# EAGLE schematic Hauptplatine (EAGLE 7.7.0)

## Sheet 1 of 3
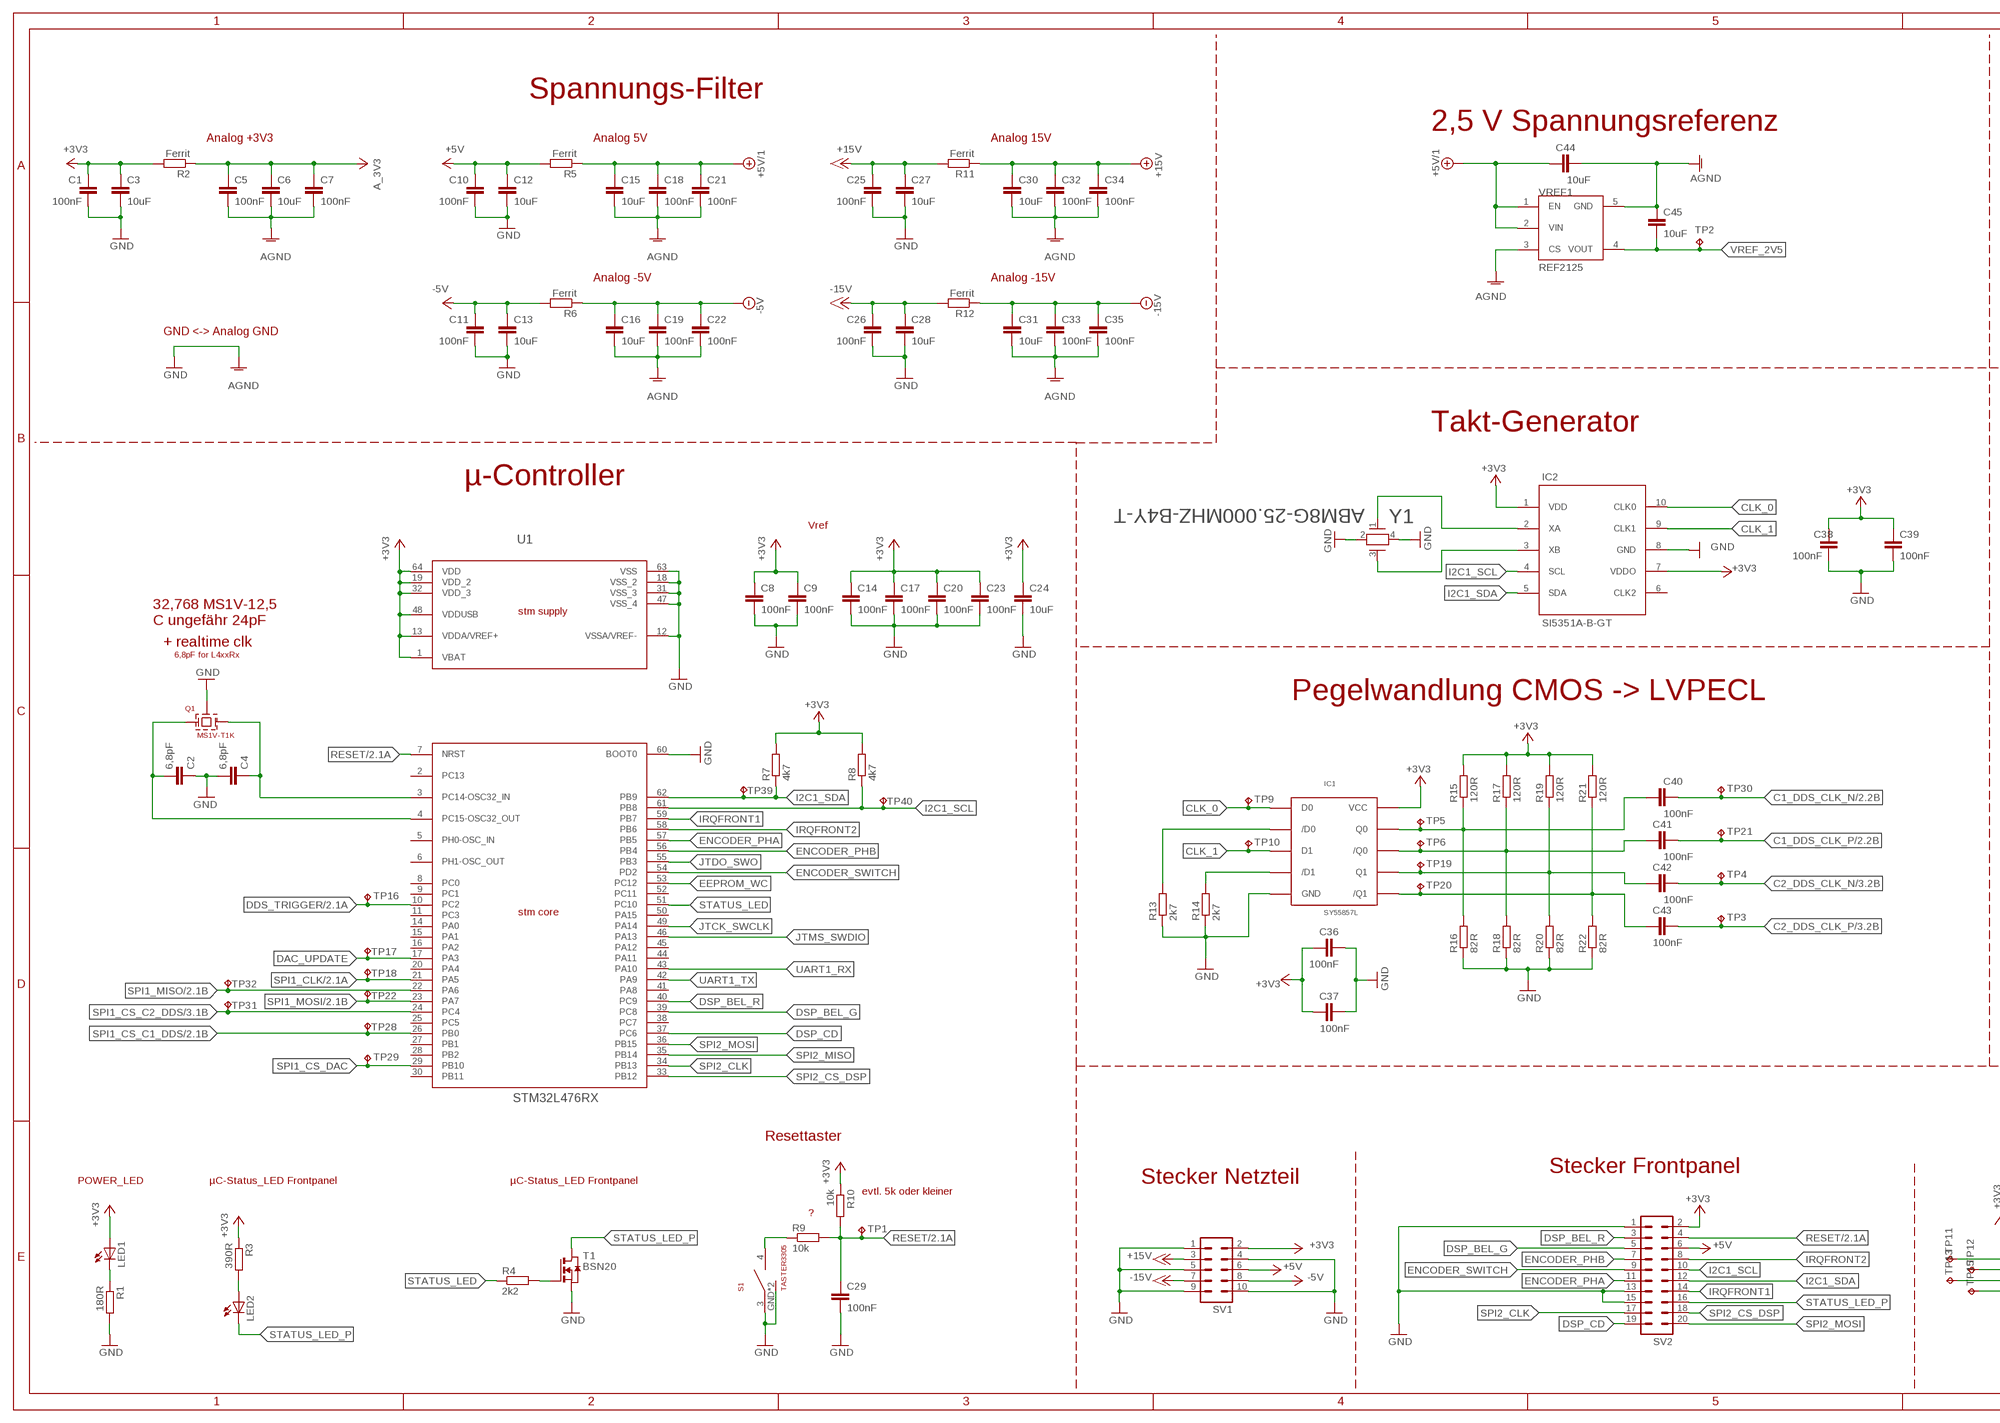
[diagram p0: schematic, sheet 1, part 1 of 2]
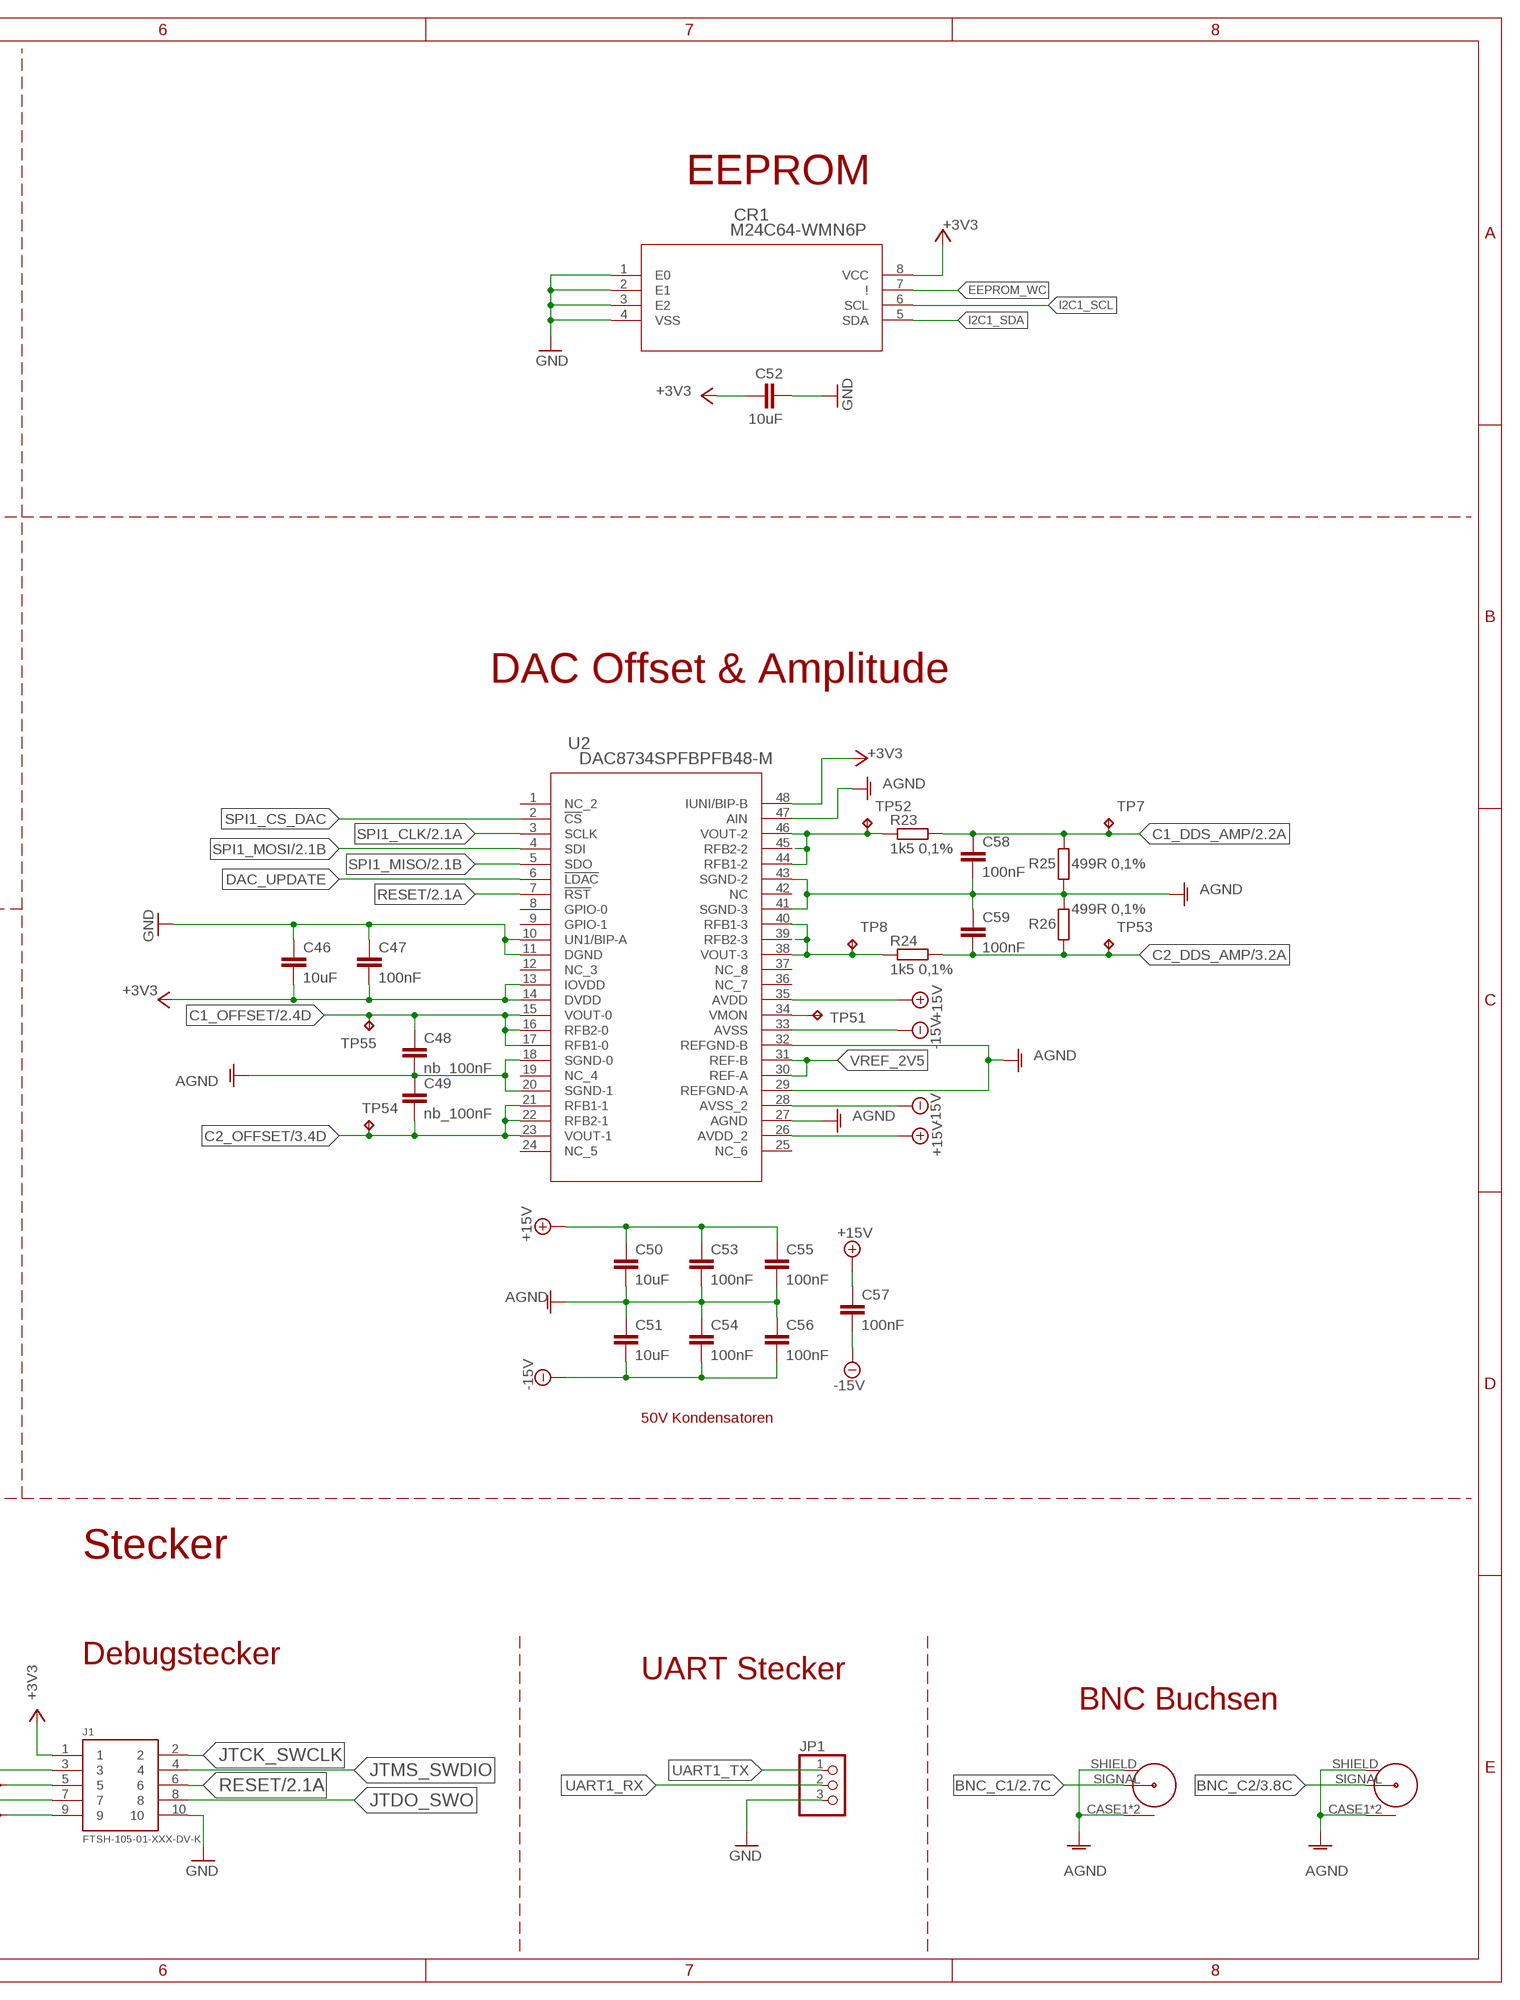
[diagram p1: schematic, sheet 1, part 2 of 2]

### Parts
C1  100nF  C-EUC0603  [C0603]
C2  6,8pF  C-EUC0603  [C0603]
C3  10uF  C-EUC0603  [C0603]
C4  6,8pF  C-EUC0603  [C0603]
C5  100nF  C-EUC0603  [C0603]
C6  10uF  C-EUC0603  [C0603]
C7  100nF  C-EUC0603  [C0603]
C8  100nF  C-EUC0603  [C0603]
C9  100nF  C-EUC0603  [C0603]
C10  100nF  C-EUC0603  [C0603]
C11  100nF  C-EUC0603  [C0603]
C12  10uF  C-EUC0603  [C0603]
C13  10uF  C-EUC0603  [C0603]
C14  100nF  C-EUC0603  [C0603]
C15  10uF  C-EUC0603  [C0603]
C16  10uF  C-EUC0603  [C0603]
C17  100nF  C-EUC0603  [C0603]
C18  100nF  C-EUC0603  [C0603]
C19  100nF  C-EUC0603  [C0603]
C20  100nF  C-EUC0603  [C0603]
C21  100nF  C-EUC0603  [C0603]
C22  100nF  C-EUC0603  [C0603]
C23  100nF  C-EUC0603  [C0603]
C24  10uF  C-EUC0603  [C0603]
C25  100nF  C-EUC0603  [C0603]
C26  100nF  C-EUC0603  [C0603]
C27  10uF  C-EUC0603  [C0603]
C28  10uF  C-EUC0603  [C0603]
C29  100nF  C-EUC0603  [C0603]
C30  10uF  C-EUC0603  [C0603]
C31  10uF  C-EUC0603  [C0603]
C32  100nF  C-EUC0603  [C0603]
C33  100nF  C-EUC0603  [C0603]
C34  100nF  C-EUC0603  [C0603]
C35  100nF  C-EUC0603  [C0603]
C36  100nF  C-EUC0603  [C0603]
C37  100nF  C-EUC0603  [C0603]
C38  100nF  C-EUC0603  [C0603]
C39  100nF  C-EUC0603  [C0603]
C40  100nF  C-EUC0603  [C0603]
C41  100nF  C-EUC0603  [C0603]
C42  100nF  C-EUC0603  [C0603]
C43  100nF  C-EUC0603  [C0603]
C44  10uF  C-EUC0603  [C0603]
C45  10uF  C-EUC0603  [C0603]
C46  10uF  C-EUC0603  [C0603]
C47  100nF  C-EUC0603  [C0603]
C48  nb_100nF  C-EUC0603  [C0603]
C49  nb_100nF  C-EUC0603  [C0603]
C50  10uF  C-EUC0603  [C0603]
C51  10uF  C-EUC0603  [C0603]
C52  10uF  C-EUC0603  [C0603]
C53  100nF  C-EUC0603  [C0603]
C54  100nF  C-EUC0603  [C0603]
C55  100nF  C-EUC0603  [C0603]
C56  100nF  C-EUC0603  [C0603]
C57  100nF  C-EUC0603  [C0603]
C58  100nF  C-EUC0603  [C0603]
C59  100nF  C-EUC0603  [C0603]
CR1  M24C64-WMN6P  [SO-8]
IC1  SY55857L  [MSOP(K10-1)]
IC2  SI5351A-B-GT  SI5351A  [MSOP10]
J1  FTSH-105-01-XXX-DV-K  [FTSH-105-01-XXX-DV-K]
JP1  PINHD-1X3  [1X03]
LED1  LEDCHIPLED_0603  [CHIPLED_0603]
LED2  LEDCHIPLED_0603  [CHIPLED_0603]
Q1  MS1V-T1K  [MS1V-T1K]
R1  180R  R-EU_R0603  [R0603]
R2  Ferrit  R-EU_R0603  [R0603]
R3  390R  R-EU_R0603  [R0603]
R4  2k2  R-EU_R0603  [R0603]
R5  Ferrit  R-EU_R0603  [R0603]
R6  Ferrit  R-EU_R0603  [R0603]
R7  4k7  R-EU_R0603  [R0603]
R8  4k7  R-EU_R0603  [R0603]
R9  10k  R-EU_R0603  [R0603]
R10  10k  R-EU_R0603  [R0603]
R11  Ferrit  R-EU_R0603  [R0603]
R12  Ferrit  R-EU_R0603  [R0603]
R13  2k7  R-EU_R0603  [R0603]
R14  2k7  R-EU_R0603  [R0603]
R15  120R  R-EU_R0603  [R0603]
R16  82R  R-EU_R0603  [R0603]
R17  120R  R-EU_R0603  [R0603]
R18  82R  R-EU_R0603  [R0603]
R19  120R  R-EU_R0603  [R0603]
R20  82R  R-EU_R0603  [R0603]
R21  120R  R-EU_R0603  [R0603]
R22  82R  R-EU_R0603  [R0603]
R23  1k5 0,1%  R-EU_R0603  [R0603]
R24  1k5 0,1%  R-EU_R0603  [R0603]
R25  499R 0,1%  R-EU_R0603  [R0603]
R26  499R 0,1%  R-EU_R0603  [R0603]
S1  TASTER3305  [TASTER3305]
SV1  ML10  [ML10]
SV2  ML20  [ML20]
T1  BSN20  NMOSSOT23  [SOT-23]
TP1  TPB1,27  [B1,27]
TP2  TPB1,27  [B1,27]
TP3  TPB1,27  [B1,27]
TP4  TPB1,27  [B1,27]
TP5  TPB1,27  [B1,27]
TP6  TPB1,27  [B1,27]
TP7  TPB1,27  [B1,27]
TP8  TPB1,27  [B1,27]
TP9  TPB1,27  [B1,27]
TP10  TPB1,27  [B1,27]
TP11  TPB1,27  [B1,27]
TP12  TPB1,27  [B1,27]
TP13  TPB1,27  [B1,27]
TP15  TPB1,27  [B1,27]
TP16  TPB1,27  [B1,27]
TP17  TPB1,27  [B1,27]
TP18  TPB1,27  [B1,27]
TP19  TPB1,27  [B1,27]
TP20  TPB1,27  [B1,27]
TP21  TPB1,27  [B1,27]
TP22  TPB1,27  [B1,27]
TP28  TPB1,27  [B1,27]
TP29  TPB1,27  [B1,27]
TP30  TPB1,27  [B1,27]
TP31  TPB1,27  [B1,27]
TP32  TPB1,27  [B1,27]
TP39  TPB1,27  [B1,27]
TP40  TPB1,27  [B1,27]
TP51  TPB1,27  [B1,27]
TP52  TPB1,27  [B1,27]
TP53  TPB1,27  [B1,27]
TP54  TPB1,27  [B1,27]
TP55  TPB1,27  [B1,27]
U1  STM32L476RX  [LQFP64-10X10MM]
U2  DAC8734SPFBPFB48-M  [PFB48-M]
VREF1  REF2125  REF2125SOT-23DBV  [SOT23-5L]
X1  740845_BNC  [740845_BNC]
X2  740845_BNC  [740845_BNC]
Y1  ABM8G-25.000MHZ-B4Y-T  ABM8G-12.000MHZ-B4Y-T  [CRYSTAL_ABM8G]

### Nets
+3V3: C1.1 C3.1 C8.1 C9.1 C14.1 C17.1 C20.1 C23.1 C24.1 C36.1 C37.1 C38.1 C39.1 C46.2 C47.2 C52.1 CR1.8(VCC) IC1.VCC IC2.1(VDD) IC2.7(VDDO) J1.1 LED1.A R2.2 R3.1 R7.2 R8.2 R10.1 R15.2 R17.2 R19.2 R21.2 SV1.2 SV2.2 U1.1(VBAT) U1.13(VDDA/VREF+) U1.19(VDD_2) U1.32(VDD_3) U1.48(VDDUSB) U1.64(VDD) U2.13(IOVDD) U2.14(DVDD) U2.48(IUNI/BIP-B) ; also sheet 2,3
+5V: C10.1 C12.1 R5.2 SV1.6 SV2.6
+5V/1: C15.1 C18.1 C21.1 C44.1 R5.1 VREF1.1(EN) VREF1.2(VIN) ; also sheet 2,3
+15V: C25.1 C27.1 R11.2 SV1.3
+18V: C30.1 C32.1 C34.1 C50.1 C53.1 C55.1 C57.1 R11.1 U2.26(AVDD_2) U2.35(AVDD) ; supply symbol labelled +15V ; also sheet 2,3
-5V: C16.1 C19.1 C22.1 R6.1 ; also sheet 2,3
-5V/D: C11.1 C13.1 R6.2 SV1.8 ; supply symbol labelled -5V
-15V: C26.1 C28.1 R12.2 SV1.7
-18V: C31.1 C33.1 C35.1 C51.2 C54.2 C56.2 C57.2 R12.1 U2.28(AVSS_2) U2.33(AVSS) ; supply symbol labelled -15V ; also sheet 2,3
ANALOG_3V3: C5.1 C6.1 C7.1 R2.1 ; supply symbol labelled A_3V3 ; also sheet 2,3
BNC_C1: X1.SIGNAL ; also sheet 2
BNC_C2: X2.SIGNAL ; also sheet 3
C1_DDS_AMP: C58.1 R23.2 R25.2 TP7.TP ; also sheet 2
C1_DDS_CLK_N: C40.1 TP30.TP ; also sheet 2
C1_DDS_CLK_P: C41.1 TP21.TP ; also sheet 2
C1_OFFSET: C48.1 TP55.TP U2.15(VOUT-0) U2.16(RFB2-0) U2.17(RFB1-0) ; also sheet 2
C2_DDS_AMP: C59.2 R24.2 R26.1 TP53.TP ; also sheet 3
C2_DDS_CLK_N: C42.1 TP4.TP ; also sheet 3
C2_DDS_CLK_P: C43.1 TP3.TP ; also sheet 3
C2_OFFSET: C49.2 TP54.TP U2.21(RFB1-1) U2.22(RFB2-1) U2.23(VOUT-1) ; also sheet 3
CLK_0: IC1.D0 IC2.10(CLK0) TP9.TP
CLK_1: IC1.D1 IC2.9(CLK1) TP10.TP
DAC_UPDATE: TP17.TP U1.17(PA3) U2.6(!LDAC)
DDS_TRIGGER: TP16.TP U1.10(PC2) ; also sheet 2,3
DSP_BEL_G: SV2.5 U1.39(PC8)
DSP_BEL_R: SV2.3 U1.40(PC9)
DSP_CD: SV2.19 U1.37(PC6)
EEPROM_WC: CR1.7(!) U1.53(PC12)
ENCODER_PHA: SV2.11 U1.57(PB5)
ENCODER_PHB: SV2.7 U1.56(PB4)
ENCODER_SWITCH: SV2.9 U1.54(PD2)
GND: C1.2 C2.1 C3.2 C4.2 C5.2 C6.2 C7.2 C8.2 C9.2 C10.2 C11.2 C12.2 C13.2 C14.2 C15.2 C16.2 C17.2 C18.2 C19.2 C20.2 C21.2 C22.2 C23.2 C24.2 C25.2 C26.2 C27.2 C28.2 C29.2 C30.2 C31.2 C32.2 C33.2 C34.2 C35.2 C36.2 C37.2 C38.2 C39.2 C44.2 C45.1 C46.1 C47.1 C48.2 C49.1 C50.2 C51.1 C52.2 C53.2 C54.1 C55.2 C56.1 C58.2 C59.1 CR1.1(E0) CR1.2(E1) CR1.3(E2) CR1.4(VSS) IC1.GND IC2.8(GND) J1.10 JP1.3 Q1.GND R1.2 R13.1 R14.1 R16.1 R18.1 R20.1 R22.1 R25.1 R26.2 S1.3 S1.GND S1.GND2(GND) SV1.1 SV1.4 SV1.5 SV1.9 SV1.10 SV2.1 SV2.13 SV2.15 T1.2(S) U1.12(VSSA/VREF-) U1.18(VSS_2) U1.31(VSS_3) U1.47(VSS_4) U1.60(BOOT0) U1.63(VSS) U2.10(UN1/BIP-A) U2.11(DGND) U2.18(SGND-0) U2.20(SGND-1) U2.27(AGND) U2.29(REFGND-A) U2.32(REFGND-B) U2.41(SGND-3) U2.43(SGND-2) U2.47(AIN) VREF1.3(CS) VREF1.5(GND) X1.CASE1(CASE) X1.CASE2(CASE) X1.SHIELD X2.CASE1(CASE) X2.CASE2(CASE) X2.SHIELD Y1.2 Y1.4 ; supply symbol labelled AGND ; also sheet 2,3
I2C1_SCL: CR1.6(SCL) IC2.4(SCL) R8.1 SV2.10 TP40.TP U1.61(PB8)
I2C1_SDA: CR1.5(SDA) IC2.5(SDA) R7.1 SV2.12 TP39.TP U1.62(PB9)
IRQFRONT1: SV2.14 U1.59(PB7)
IRQFRONT2: SV2.8 U1.58(PB6)
JTCK_SWCLK: J1.2 U1.49(PA14)
JTDO_SWO: J1.8 U1.55(PB3)
JTMS_SWDIO: J1.4 U1.46(PA13)
N$1: R9.1 S1.4
N$2: LED1.C R1.1
N$4: R23.1 TP52.TP U2.44(RFB1-2) U2.45(RFB2-2) U2.46(VOUT-2)
N$13: IC2.2(XA) Y1.1
N$15: IC2.3(XB) Y1.3
N$17: J1.3 TP11.TP
N$21: R24.1 TP8.TP U2.38(VOUT-3) U2.39(RFB2-3) U2.40(RFB1-3)
N$23: C2.2 Q1.1 U1.4(PC15-OSC32_OUT)
N$27: R4.2 T1.3(G)
N$30: LED2.A R3.2
N$31: J1.5 TP12.TP
N$34: J1.7 TP13.TP
N$35: IC1./D1 R14.2
N$36: IC1./D0 R13.2
N$37: C40.2 IC1.Q0 R15.1 R16.2 TP5.TP
N$38: C41.2 IC1./Q0 R17.1 R18.2 TP6.TP
N$39: C42.2 IC1.Q1 R19.1 R20.2 TP19.TP
N$40: J1.9 TP15.TP
N$41: C43.2 IC1./Q1 R21.1 R22.2 TP20.TP
N$46: TP51.TP U2.34(VMON)
N$47: C4.1 Q1.2 U1.3(PC14-OSC32_IN)
RESET: C29.1 J1.6 R9.2 R10.2 SV2.4 TP1.TP U1.7(NRST) U2.7(!RST) ; also sheet 2,3
SPI1_CLK: TP18.TP U1.21(PA5) U2.3(SCLK) ; also sheet 2,3
SPI1_CS_C1_DDS: TP28.TP U1.26(PB0) ; also sheet 2
SPI1_CS_C2_DDS: TP31.TP U1.24(PC4) ; also sheet 3
SPI1_CS_DAC: TP29.TP U1.29(PB10) U2.2(!CS)
SPI1_MISO: TP32.TP U1.22(PA6) U2.5(SDO) ; also sheet 2,3
SPI1_MOSI: TP22.TP U1.23(PA7) U2.4(SDI) ; also sheet 2,3
SPI2_CLK: SV2.17 U1.34(PB13)
SPI2_CS_DSP: SV2.18 U1.33(PB12)
SPI2_MISO: U1.35(PB14)
SPI2_MOSI: SV2.20 U1.36(PB15)
STATUS_LED: R4.1 U1.51(PC10)
STATUS_LED_P: LED2.C SV2.16 T1.1(D)
UART1_RX: JP1.2 U1.43(PA10)
UART1_TX: JP1.1 U1.42(PA9)
VREF_2V5: C45.2 TP2.TP U2.30(REF-A) U2.31(REF-B) VREF1.4(VOUT)
Unconnected: IC2.6(CLK2) U1.2(PC13) U1.5(PH0-OSC_IN) U1.6(PH1-OSC_OUT) U1.8(PC0) U1.9(PC1) U1.11(PC3) U1.14(PA0) U1.15(PA1) U1.16(PA2) U1.20(PA4) U1.25(PC5) U1.27(PB1) U1.28(PB2) U1.30(PB11) U1.38(PC7) U1.41(PA8) U1.44(PA11) U1.45(PA12) U1.50(PA15) U1.52(PC11) U2.1(NC_2) U2.8(GPIO-0) U2.9(GPIO-1) U2.12(NC_3) U2.19(NC_4) U2.24(NC_5) U2.25(NC_6) U2.36(NC_7) U2.37(NC_8) U2.42(NC)

### Notes on the sheet
- Logicboard Waveformgenerator V2
- Spannungs-Filter
- 2,5 V Spannungsreferenz | EEPROM
- Analog +3V3 | Analog 5V | Analog 15V
- Analog -5V | Analog -15V
- GND <-> Analog GND
- Takt-Generator
- µ-Controller | DAC Offset & Amplitude
- Vref
- 32,768 MS1V-12,5
  C ungefähr 24pF
- + realtime clk
- 6,8pF for L4xxRx
- Pegelwandlung CMOS -> LVPECL
- 50V Kondensatoren
- Stecker
- Resettaster
- Stecker Frontpanel
- POWER_LED | µC-Status_LED Frontpanel | µC-Status_LED Frontpanel | Stecker Netzteil | Debugstecker
- evtl. 5k oder kleiner | UART Stecker
- ? | BNC Buchsen

## Sheet 2 of 3: Channel 1
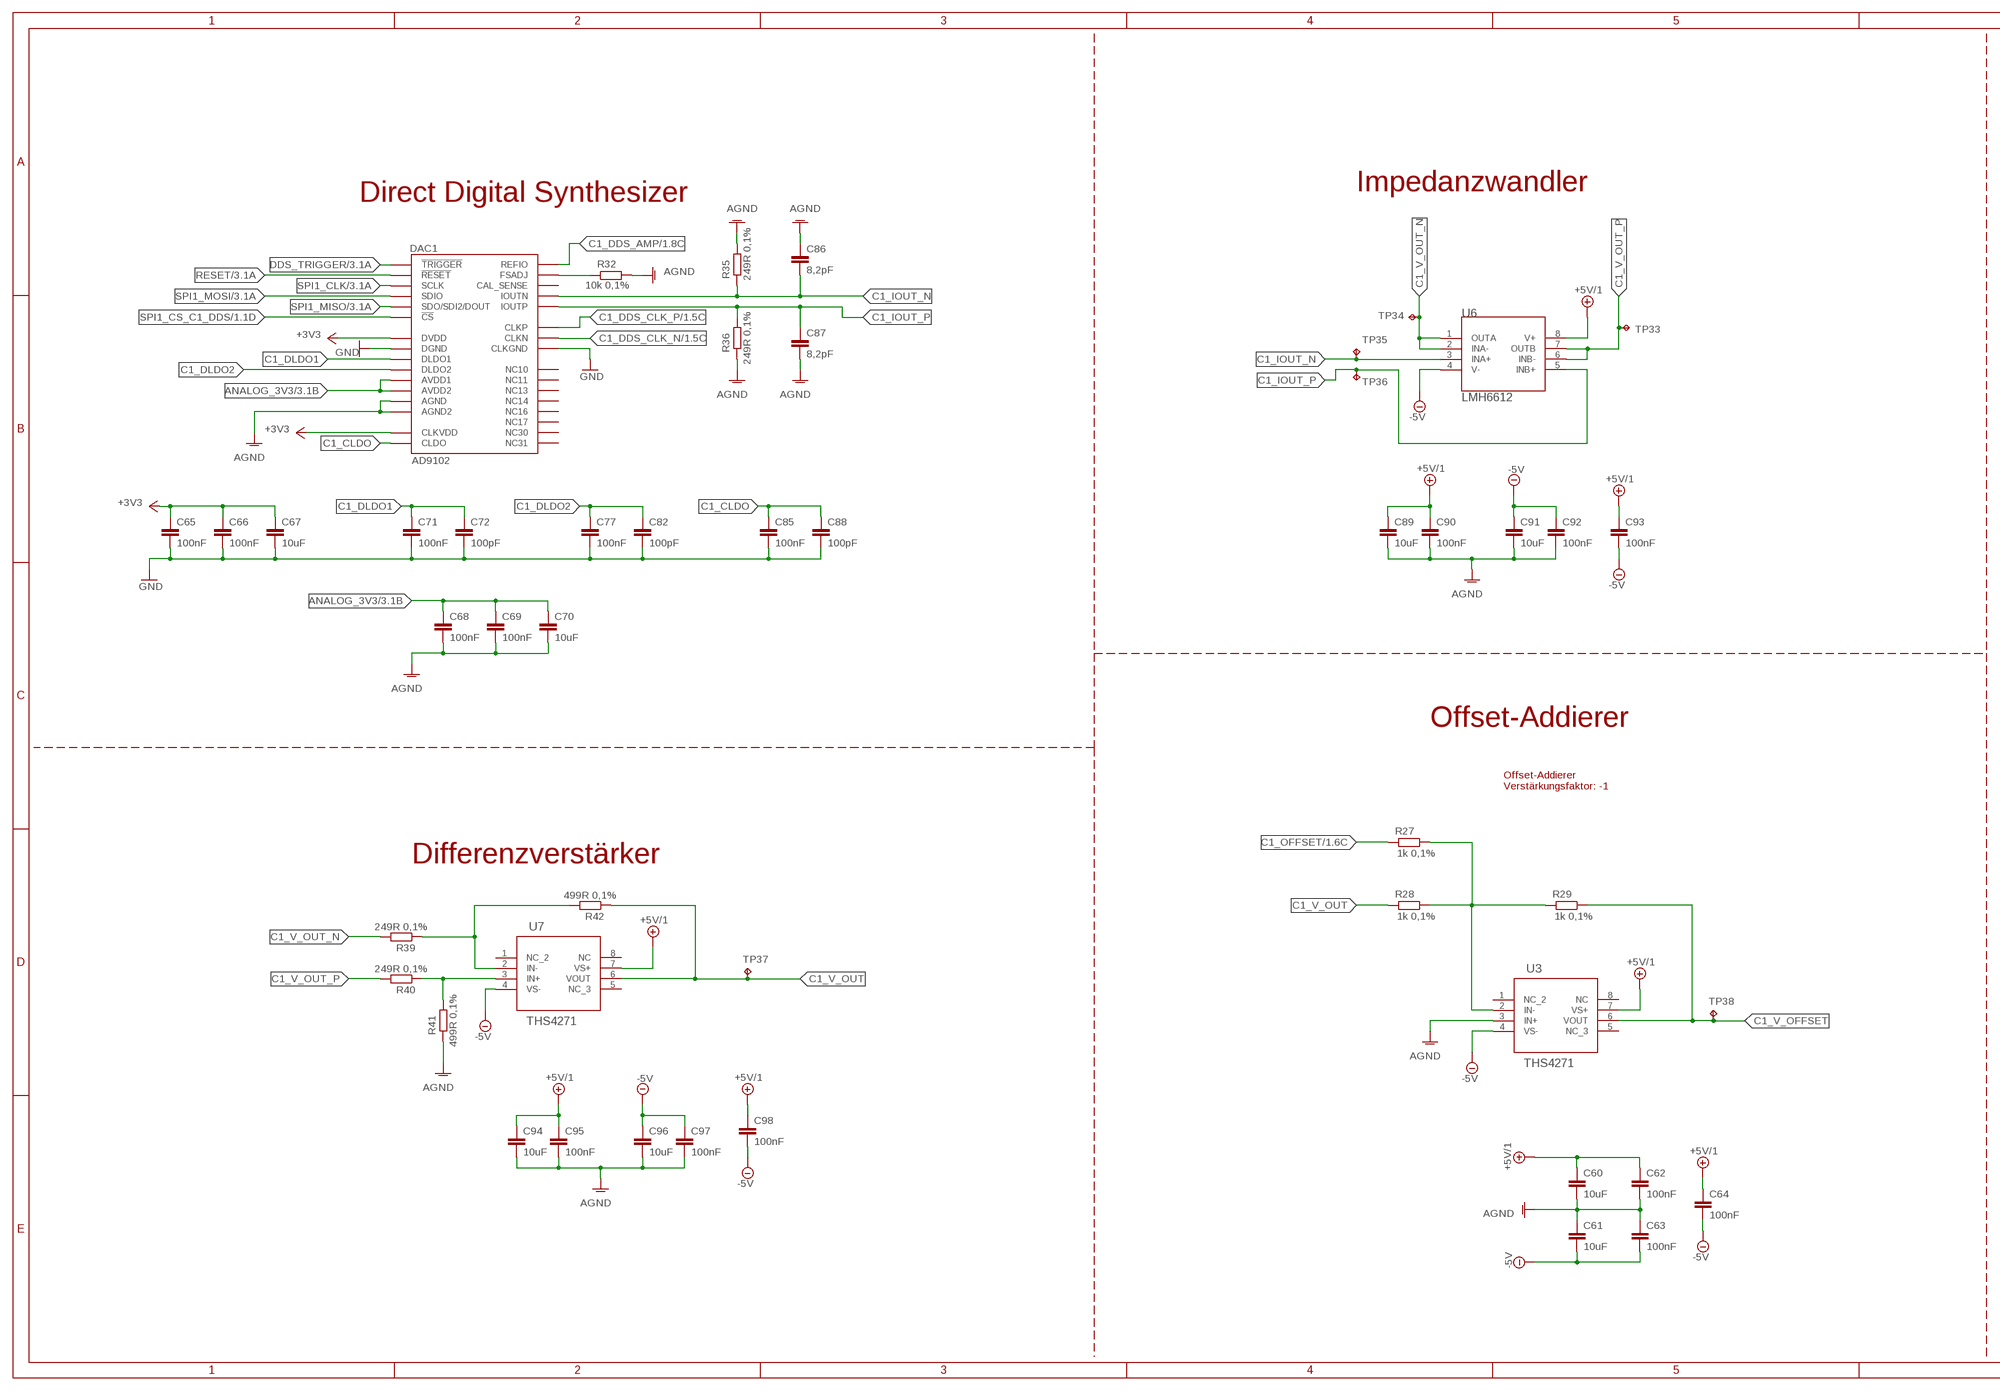
[diagram p2: schematic, sheet 2, part 1 of 2]
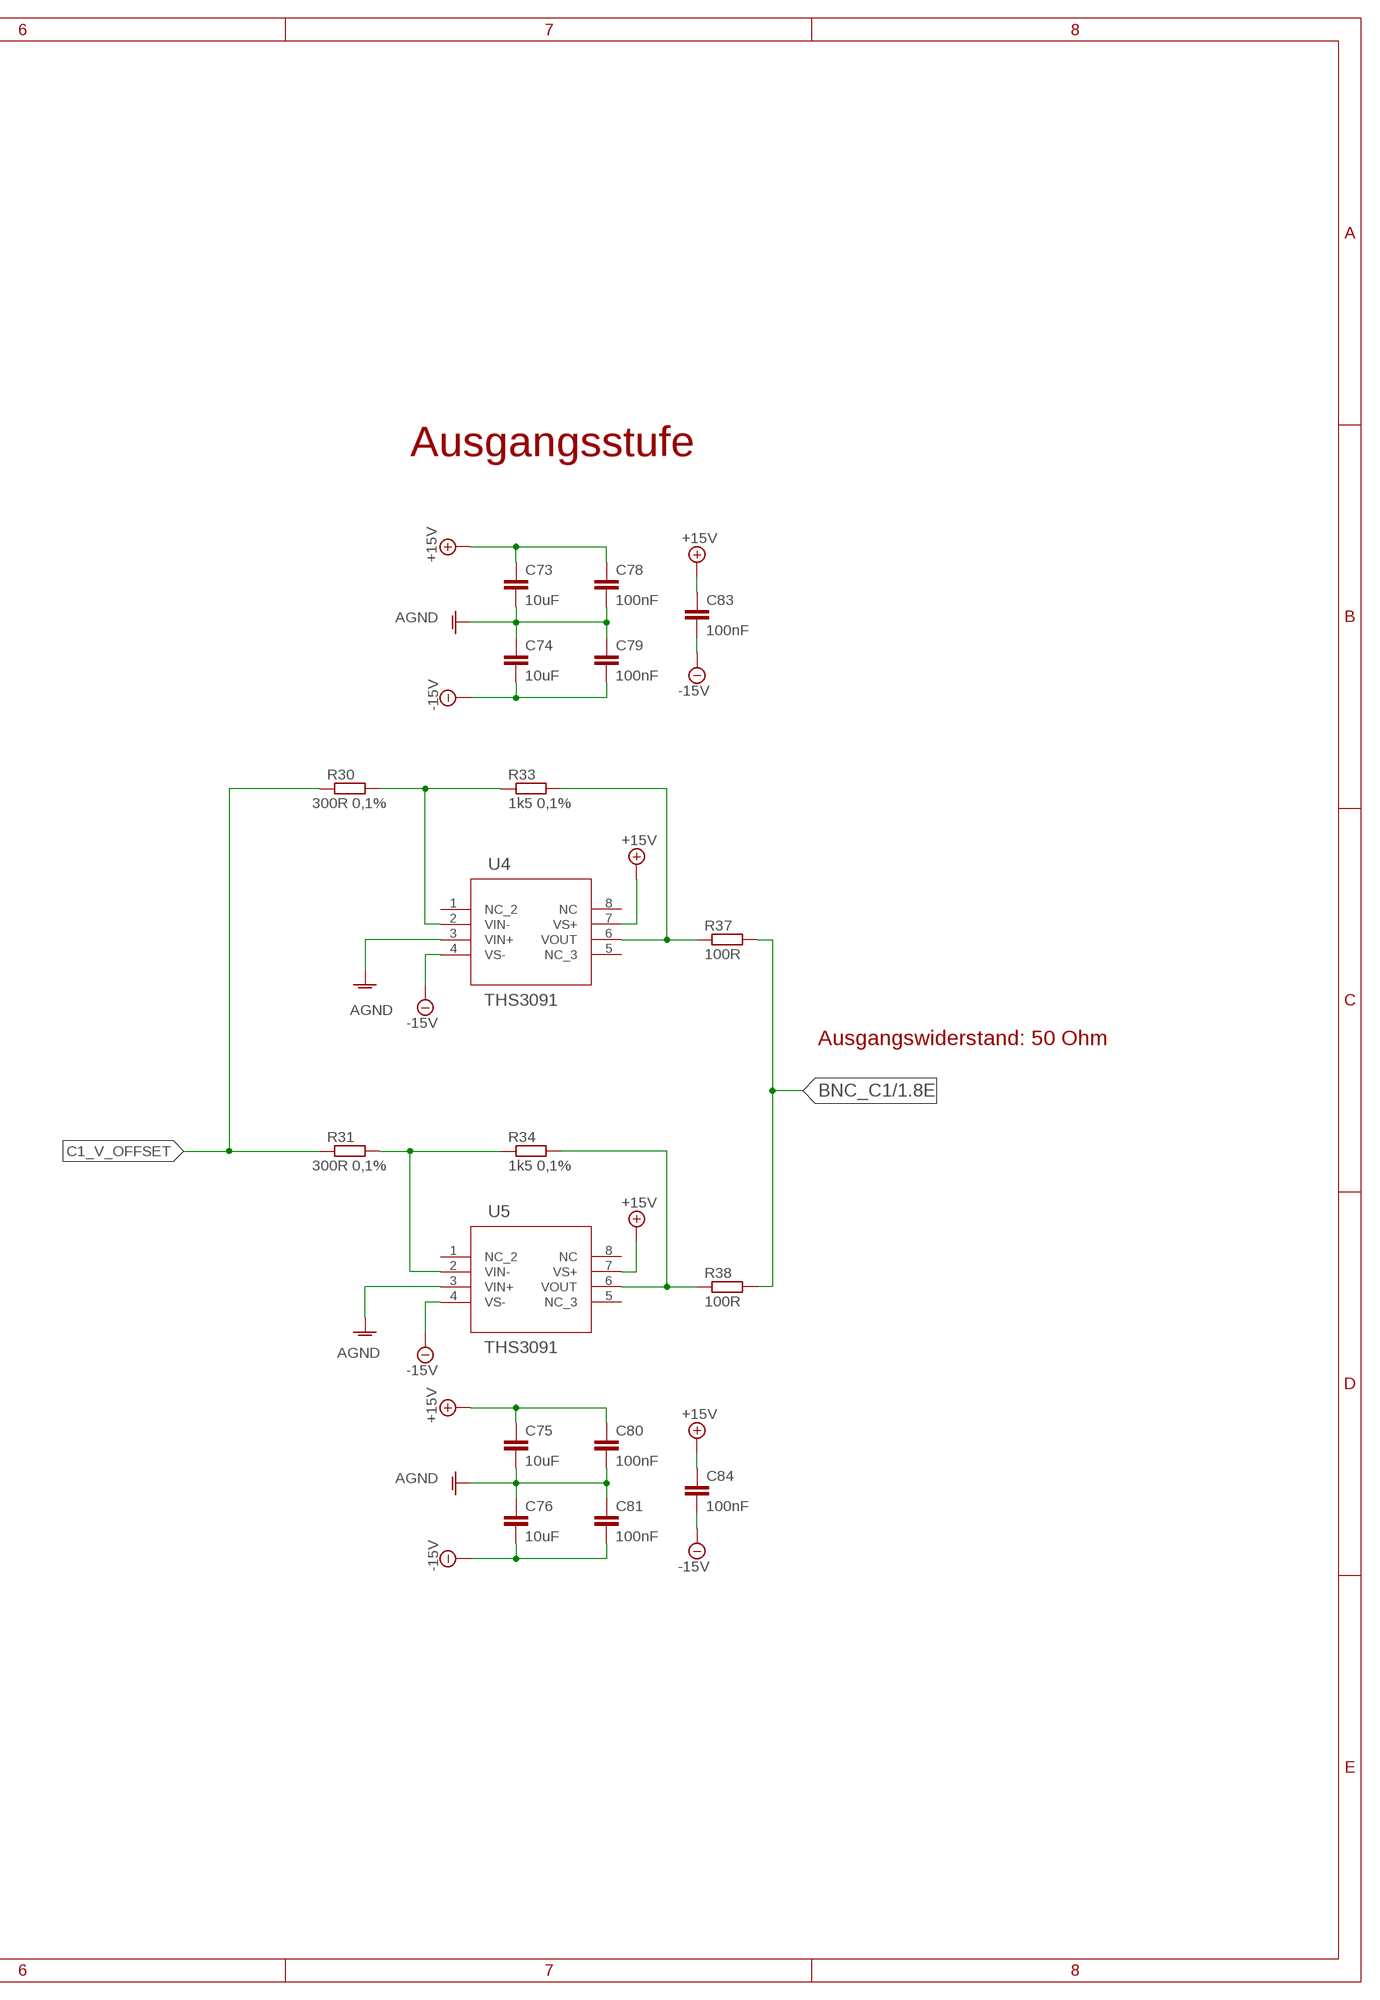
[diagram p3: schematic, sheet 2, part 2 of 2]

### Parts
C60  10uF  C-EUC0603  [C0603]
C61  10uF  C-EUC0603  [C0603]
C62  100nF  C-EUC0603  [C0603]
C63  100nF  C-EUC0603  [C0603]
C64  100nF  C-EUC0603  [C0603]
C65  100nF  C-EUC0603  [C0603]
C66  100nF  C-EUC0603  [C0603]
C67  10uF  C-EUC0603  [C0603]
C68  100nF  C-EUC0603  [C0603]
C69  100nF  C-EUC0603  [C0603]
C70  10uF  C-EUC0603  [C0603]
C71  100nF  C-EUC0603  [C0603]
C72  100pF  C-EUC0603  [C0603]
C73  10uF  C-EUC0603  [C0603]
C74  10uF  C-EUC0603  [C0603]
C75  10uF  C-EUC0603  [C0603]
C76  10uF  C-EUC0603  [C0603]
C77  100nF  C-EUC0603  [C0603]
C78  100nF  C-EUC0603  [C0603]
C79  100nF  C-EUC0603  [C0603]
C80  100nF  C-EUC0603  [C0603]
C81  100nF  C-EUC0603  [C0603]
C82  100pF  C-EUC0603  [C0603]
C83  100nF  C-EUC0603  [C0603]
C84  100nF  C-EUC0603  [C0603]
C85  100nF  C-EUC0603  [C0603]
C86  8,2pF  C-EUC0603  [C0603]
C87  8,2pF  C-EUC0603  [C0603]
C88  100pF  C-EUC0603  [C0603]
C89  10uF  C-EUC0603  [C0603]
C90  100nF  C-EUC0603  [C0603]
C91  10uF  C-EUC0603  [C0603]
C92  100nF  C-EUC0603  [C0603]
C93  100nF  C-EUC0603  [C0603]
C94  10uF  C-EUC0603  [C0603]
C95  100nF  C-EUC0603  [C0603]
C96  10uF  C-EUC0603  [C0603]
C97  100nF  C-EUC0603  [C0603]
C98  100nF  C-EUC0603  [C0603]
DAC1  AD9102  [CP_32_12]
R27  1k 0,1%  R-EU_R0603  [R0603]
R28  1k 0,1%  R-EU_R0603  [R0603]
R29  1k 0,1%  R-EU_R0603  [R0603]
R30  300R 0,1%  R-EU_R0603  [R0603]
R31  300R 0,1%  R-EU_R0603  [R0603]
R32  10k 0,1%  R-EU_R0603  [R0603]
R33  1k5 0,1%  R-EU_R0603  [R0603]
R34  1k5 0,1%  R-EU_R0603  [R0603]
R35  249R 0,1%  R-EU_R0603  [R0603]
R36  249R 0,1%  R-EU_R0603  [R0603]
R37  100R  R-EU_R0603  [R0603]
R38  100R  R-EU_R0603  [R0603]
R39  249R 0,1%  R-EU_R0603  [R0603]
R40  249R 0,1%  R-EU_R0603  [R0603]
R41  499R 0,1%  R-EU_R0603  [R0603]
R42  499R 0,1%  R-EU_R0603  [R0603]
TP33  TPB1,27  [B1,27]
TP34  TPB1,27  [B1,27]
TP35  TPB1,27  [B1,27]
TP36  TPB1,27  [B1,27]
TP37  TPB1,27  [B1,27]
TP38  TPB1,27  [B1,27]
U3  THS4271  THS4271_D_8D8-M  [D8-M]
U4  THS3091  THS3091_D_8D8-M  [D8-M]
U5  THS3091  THS3091_D_8D8-M  [D8-M]
U6  LMH6612  LMH6612MAX/NOPBM08A-M  [M08A-M]
U7  THS4271  THS4271_D_8D8-M  [D8-M]

### Nets
+3V3: C65.1 C66.1 C67.1 DAC1.5(DVDD) DAC1.23(CLKVDD) ; also sheet 1,3
+5V/1: C60.1 C62.1 C64.1 C89.1 C90.1 C93.1 C94.1 C95.1 C98.1 U3.7(VS+) U6.8(V+) U7.7(VS+) ; also sheet 1,3
+18V: C73.1 C75.1 C78.1 C80.1 C83.1 C84.1 U4.7(VS+) U5.7(VS+) ; supply symbol labelled +15V ; also sheet 1,3
-5V: C61.2 C63.2 C64.2 C91.1 C92.1 C93.2 C96.1 C97.1 C98.2 U3.4(VS-) U6.4(V-) U7.4(VS-) ; also sheet 1,3
-18V: C74.2 C76.2 C79.2 C81.2 C83.2 C84.2 U4.4(VS-) U5.4(VS-) ; supply symbol labelled -15V ; also sheet 1,3
ANALOG_3V3: C68.1 C69.1 C70.1 DAC1.12(AVDD2) DAC1.29(AVDD1) ; also sheet 1,3
BNC_C1: R37.2 R38.2 ; also sheet 1
C1_CLDO: C85.1 C88.1 DAC1.22(CLDO)
C1_DDS_AMP: DAC1.18(REFIO) ; also sheet 1
C1_DDS_CLK_N: DAC1.20(CLKN) ; also sheet 1
C1_DDS_CLK_P: DAC1.21(CLKP) ; also sheet 1
C1_DLDO1: C71.1 C72.1 DAC1.6(DLDO1)
C1_DLDO2: C77.1 C82.1 DAC1.4(DLDO2)
C1_IOUT_N: C86.2 DAC1.28(IOUTN) R35.1 TP35.TP U6.3(INA+)
C1_IOUT_P: C87.1 DAC1.27(IOUTP) R36.2 TP36.TP U6.5(INB+)
C1_OFFSET: R27.2 ; also sheet 1
C1_V_OFFSET: R29.1 R30.1 R31.1 TP38.TP U3.6(VOUT)
C1_V_OUT: R28.2 R42.1 TP37.TP U7.6(VOUT)
C1_V_OUT_N: R39.2 TP34.TP U6.1(OUTA) U6.2(INA-)
C1_V_OUT_P: R40.2 TP33.TP U6.6(INB-) U6.7(OUTB)
DDS_TRIGGER: DAC1.32(!TRIGGER) ; also sheet 1,3
GND: C60.2 C61.1 C62.2 C63.1 C65.2 C66.2 C67.2 C68.2 C69.2 C70.2 C71.2 C72.2 C73.2 C74.1 C75.2 C76.1 C77.2 C78.2 C79.1 C80.2 C81.1 C82.2 C85.2 C86.1 C87.2 C88.2 C89.2 C90.2 C91.2 C92.2 C94.2 C95.2 C96.2 C97.2 DAC1.3(DGND) DAC1.15(AGND) DAC1.19(CLKGND) DAC1.26(AGND2) DAC1.33(DGND) R32.2 R35.2 R36.1 R41.1 U3.3(IN+) U4.3(VIN+) U5.3(VIN+) ; supply symbol labelled AGND ; also sheet 1,3
N$3: DAC1.25(FSADJ) R32.1
N$14: R40.1 R41.2 U7.3(IN+)
N$16: R39.1 R42.2 U7.2(IN-)
N$25: R33.2 R37.1 U4.6(VOUT)
N$26: R31.2 R34.1 U5.2(VIN-)
N$28: R34.2 R38.1 U5.6(VOUT)
N$33: R30.2 R33.1 U4.2(VIN-)
N$42: R27.1 R28.1 R29.2 U3.2(IN-)
RESET: DAC1.9(!RESET) ; also sheet 1,3
SPI1_CLK: DAC1.1(SCLK) ; also sheet 1,3
SPI1_CS_C1_DDS: DAC1.8(!CS) ; also sheet 1
SPI1_MISO: DAC1.7(SDO/SDI2/DOUT) ; also sheet 1,3
SPI1_MOSI: DAC1.2(SDIO) ; also sheet 1,3
Unconnected: DAC1.10(NC10) DAC1.11(NC11) DAC1.13(NC13) DAC1.14(NC14) DAC1.16(NC16) DAC1.17(NC17) DAC1.24(CAL_SENSE) DAC1.30(NC30) DAC1.31(NC31) U3.1(NC_2) U3.5(NC_3) U3.8(NC) U4.1(NC_2) U4.5(NC_3) U4.8(NC) U5.1(NC_2) U5.5(NC_3) U5.8(NC) U7.1(NC_2) U7.5(NC_3) U7.8(NC)

### Notes on the sheet
- Signalerzeugung Kanal 1
- Impedanzwandler
- Direct Digital Synthesizer
- Ausgangsstufe
- Offset-Addierer | Ausgangswiderstand: 50 Ohm
- Offset-Addierer
  Verstärkungsfaktor: -1
- Differenzverstärker

## Sheet 3 of 3: Channel 2
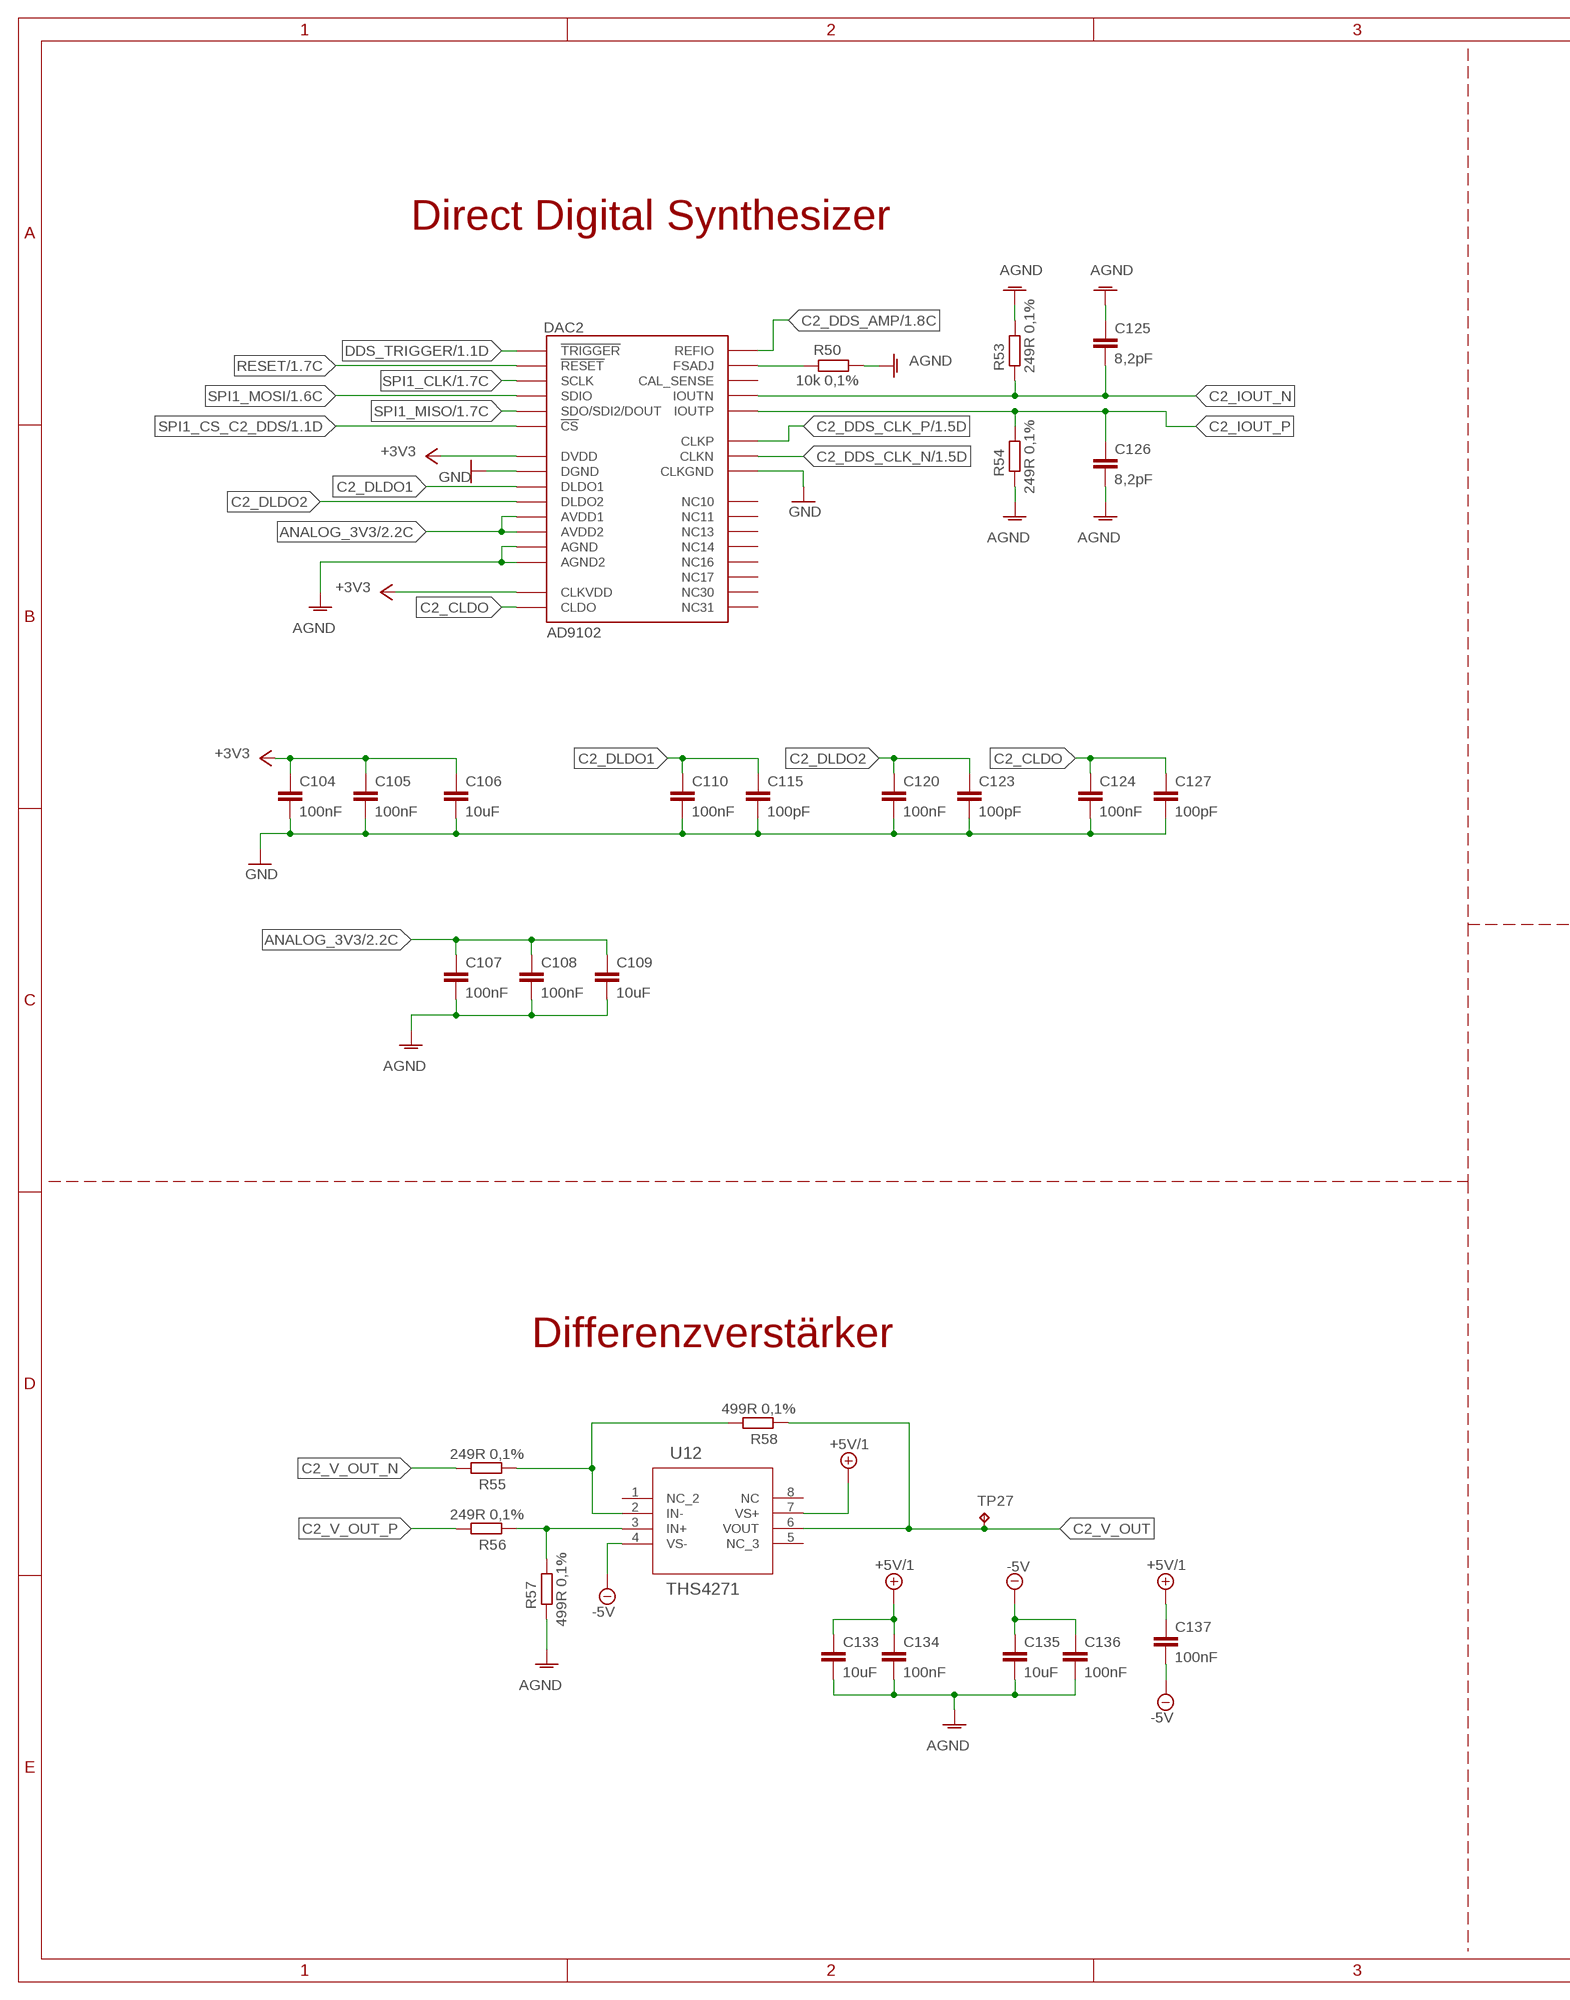
[diagram p4: schematic, sheet 3, part 1 of 2]
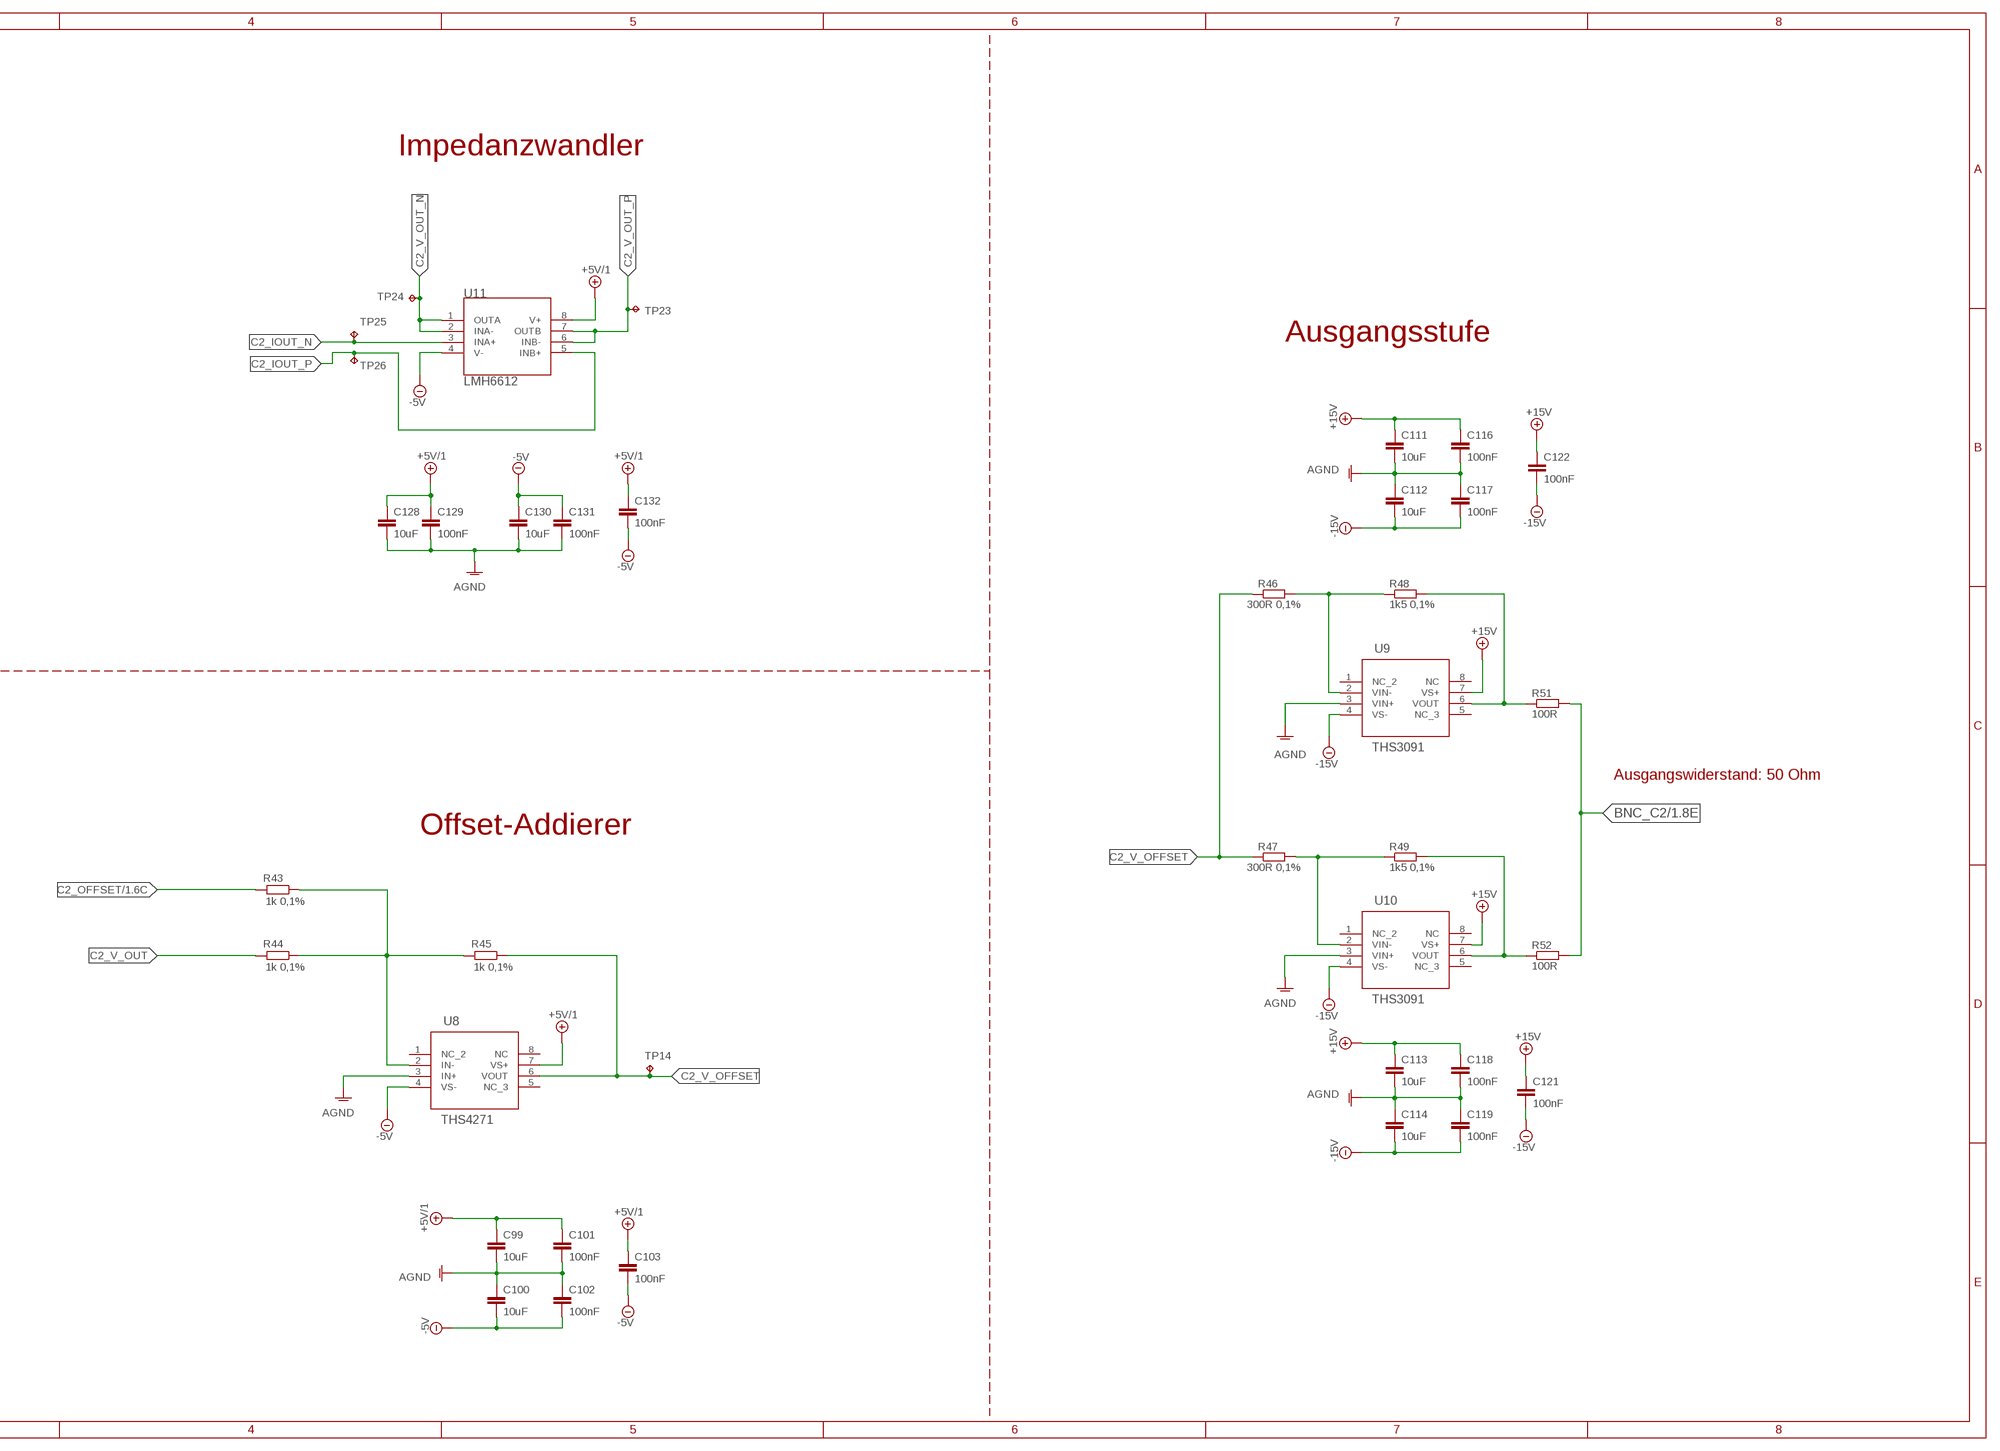
[diagram p5: schematic, sheet 3, part 2 of 2]

### Parts
C99  10uF  C-EUC0603  [C0603]
C100  10uF  C-EUC0603  [C0603]
C101  100nF  C-EUC0603  [C0603]
C102  100nF  C-EUC0603  [C0603]
C103  100nF  C-EUC0603  [C0603]
C104  100nF  C-EUC0603  [C0603]
C105  100nF  C-EUC0603  [C0603]
C106  10uF  C-EUC0603  [C0603]
C107  100nF  C-EUC0603  [C0603]
C108  100nF  C-EUC0603  [C0603]
C109  10uF  C-EUC0603  [C0603]
C110  100nF  C-EUC0603  [C0603]
C111  10uF  C-EUC0603  [C0603]
C112  10uF  C-EUC0603  [C0603]
C113  10uF  C-EUC0603  [C0603]
C114  10uF  C-EUC0603  [C0603]
C115  100pF  C-EUC0603  [C0603]
C116  100nF  C-EUC0603  [C0603]
C117  100nF  C-EUC0603  [C0603]
C118  100nF  C-EUC0603  [C0603]
C119  100nF  C-EUC0603  [C0603]
C120  100nF  C-EUC0603  [C0603]
C121  100nF  C-EUC0603  [C0603]
C122  100nF  C-EUC0603  [C0603]
C123  100pF  C-EUC0603  [C0603]
C124  100nF  C-EUC0603  [C0603]
C125  8,2pF  C-EUC0603  [C0603]
C126  8,2pF  C-EUC0603  [C0603]
C127  100pF  C-EUC0603  [C0603]
C128  10uF  C-EUC0603  [C0603]
C129  100nF  C-EUC0603  [C0603]
C130  10uF  C-EUC0603  [C0603]
C131  100nF  C-EUC0603  [C0603]
C132  100nF  C-EUC0603  [C0603]
C133  10uF  C-EUC0603  [C0603]
C134  100nF  C-EUC0603  [C0603]
C135  10uF  C-EUC0603  [C0603]
C136  100nF  C-EUC0603  [C0603]
C137  100nF  C-EUC0603  [C0603]
DAC2  AD9102  [CP_32_12]
R43  1k 0,1%  R-EU_R0603  [R0603]
R44  1k 0,1%  R-EU_R0603  [R0603]
R45  1k 0,1%  R-EU_R0603  [R0603]
R46  300R 0,1%  R-EU_R0603  [R0603]
R47  300R 0,1%  R-EU_R0603  [R0603]
R48  1k5 0,1%  R-EU_R0603  [R0603]
R49  1k5 0,1%  R-EU_R0603  [R0603]
R50  10k 0,1%  R-EU_R0603  [R0603]
R51  100R  R-EU_R0603  [R0603]
R52  100R  R-EU_R0603  [R0603]
R53  249R 0,1%  R-EU_R0603  [R0603]
R54  249R 0,1%  R-EU_R0603  [R0603]
R55  249R 0,1%  R-EU_R0603  [R0603]
R56  249R 0,1%  R-EU_R0603  [R0603]
R57  499R 0,1%  R-EU_R0603  [R0603]
R58  499R 0,1%  R-EU_R0603  [R0603]
TP14  TPB1,27  [B1,27]
TP23  TPB1,27  [B1,27]
TP24  TPB1,27  [B1,27]
TP25  TPB1,27  [B1,27]
TP26  TPB1,27  [B1,27]
TP27  TPB1,27  [B1,27]
U8  THS4271  THS4271_D_8D8-M  [D8-M]
U9  THS3091  THS3091_D_8D8-M  [D8-M]
U10  THS3091  THS3091_D_8D8-M  [D8-M]
U11  LMH6612  LMH6612MAX/NOPBM08A-M  [M08A-M]
U12  THS4271  THS4271_D_8D8-M  [D8-M]

### Nets
+3V3: C104.1 C105.1 C106.1 DAC2.5(DVDD) DAC2.23(CLKVDD) ; also sheet 1,2
+5V/1: C99.1 C101.1 C103.1 C128.1 C129.1 C132.1 C133.1 C134.1 C137.1 U8.7(VS+) U11.8(V+) U12.7(VS+) ; also sheet 1,2
+18V: C111.1 C113.1 C116.1 C118.1 C121.1 C122.1 U9.7(VS+) U10.7(VS+) ; supply symbol labelled +15V ; also sheet 1,2
-5V: C100.2 C102.2 C103.2 C130.1 C131.1 C132.2 C135.1 C136.1 C137.2 U8.4(VS-) U11.4(V-) U12.4(VS-) ; also sheet 1,2
-18V: C112.2 C114.2 C117.2 C119.2 C121.2 C122.2 U9.4(VS-) U10.4(VS-) ; supply symbol labelled -15V ; also sheet 1,2
ANALOG_3V3: C107.1 C108.1 C109.1 DAC2.12(AVDD2) DAC2.29(AVDD1) ; also sheet 1,2
BNC_C2: R51.2 R52.2 ; also sheet 1
C2_CLDO: C124.1 C127.1 DAC2.22(CLDO)
C2_DDS_AMP: DAC2.18(REFIO) ; also sheet 1
C2_DDS_CLK_N: DAC2.20(CLKN) ; also sheet 1
C2_DDS_CLK_P: DAC2.21(CLKP) ; also sheet 1
C2_DLDO1: C110.1 C115.1 DAC2.6(DLDO1)
C2_DLDO2: C120.1 C123.1 DAC2.4(DLDO2)
C2_IOUT_N: C125.2 DAC2.28(IOUTN) R53.1 TP25.TP U11.3(INA+)
C2_IOUT_P: C126.1 DAC2.27(IOUTP) R54.2 TP26.TP U11.5(INB+)
C2_OFFSET: R43.2 ; also sheet 1
C2_V_OFFSET: R45.1 R46.1 R47.1 TP14.TP U8.6(VOUT)
C2_V_OUT: R44.2 R58.1 TP27.TP U12.6(VOUT)
C2_V_OUT_N: R55.2 TP24.TP U11.1(OUTA) U11.2(INA-)
C2_V_OUT_P: R56.2 TP23.TP U11.6(INB-) U11.7(OUTB)
DDS_TRIGGER: DAC2.32(!TRIGGER) ; also sheet 1,2
GND: C99.2 C100.1 C101.2 C102.1 C104.2 C105.2 C106.2 C107.2 C108.2 C109.2 C110.2 C111.2 C112.1 C113.2 C114.1 C115.2 C116.2 C117.1 C118.2 C119.1 C120.2 C123.2 C124.2 C125.1 C126.2 C127.2 C128.2 C129.2 C130.2 C131.2 C133.2 C134.2 C135.2 C136.2 DAC2.3(DGND) DAC2.15(AGND) DAC2.19(CLKGND) DAC2.26(AGND2) DAC2.33(DGND) R50.2 R53.2 R54.1 R57.1 U8.3(IN+) U9.3(VIN+) U10.3(VIN+) ; supply symbol labelled AGND ; also sheet 1,2
N$5: DAC2.25(FSADJ) R50.1
N$10: R56.1 R57.2 U12.3(IN+)
N$11: R55.1 R58.2 U12.2(IN-)
N$18: R48.2 R51.1 U9.6(VOUT)
N$19: R47.2 R49.1 U10.2(VIN-)
N$20: R49.2 R52.1 U10.6(VOUT)
N$24: R46.2 R48.1 U9.2(VIN-)
N$29: R43.1 R44.1 R45.2 U8.2(IN-)
RESET: DAC2.9(!RESET) ; also sheet 1,2
SPI1_CLK: DAC2.1(SCLK) ; also sheet 1,2
SPI1_CS_C2_DDS: DAC2.8(!CS) ; also sheet 1
SPI1_MISO: DAC2.7(SDO/SDI2/DOUT) ; also sheet 1,2
SPI1_MOSI: DAC2.2(SDIO) ; also sheet 1,2
Unconnected: DAC2.10(NC10) DAC2.11(NC11) DAC2.13(NC13) DAC2.14(NC14) DAC2.16(NC16) DAC2.17(NC17) DAC2.24(CAL_SENSE) DAC2.30(NC30) DAC2.31(NC31) U8.1(NC_2) U8.5(NC_3) U8.8(NC) U9.1(NC_2) U9.5(NC_3) U9.8(NC) U10.1(NC_2) U10.5(NC_3) U10.8(NC) U12.1(NC_2) U12.5(NC_3) U12.8(NC)

### Notes on the sheet
- Signalerzeugung Kanal 2
- Impedanzwandler
- Direct Digital Synthesizer
- Ausgangsstufe
- Ausgangswiderstand: 50 Ohm
- Offset-Addierer
- Differenzverstärker

## Library data of the parts
C1-C137 = resistor:C-EU: CAPACITOR, European symbol
CR1 = wavegen:M24C64-WMN6P; MANUFACTURER_PART_NUMBER: M24C64WMN6P; VENDOR: STMicroelectronics
DAC1 DAC2 = wavegen:AD9102
IC1 = wavegen:SY55857L
IC2 = wavegen:SI5351A
J1 = FTSH-105-01-XXX-DV-K:FTSH-105-01-XXX-DV-K: 0.05"x0.05" DOUBLE ROW SMT STRIP ASSEMBLY. MANUFACTURER:SAMTEC.
JP1 = pinhead:PINHD-1X3: PIN HEADER
LED1 LED2 = led:LED: LED OSRAM: - CHIPLED LG R971, LG N971, LY N971, LG Q971, LY Q971, LO R971, LY R971 LH N974, LH R974 LS Q976, LO Q976, LY Q976 LO Q996 - Hyper CHIPLED LW Q18S LB Q993, LB Q99A, LB R99A - SideLED LS A670, LO A670, LY A670, LG A670, LP A670 LB A673, LV A673, LT A673, LW A673 LH A674 LY A675 LS A676, LA A676, LO A676, LY A676, LW A676 LS A679, LY A679, LG A679 - Hyper Micro SIDELED® LS Y876, LA Y876, LO Y876, LY Y876 LT Y87S - SmartLED LW L88C, LW L88S LB L89C, LB L89S, LG L890 LS L89K, LO L89K, LY L89K LS L896, LA L896, LO L896, LY L896 - TOPLED LS T670, LO T670, LY T670, LG T670, LP T670 LSG T670, LSP T670, LSY T670, LOP T670, LYG T670 LG T671, LOG T671, LSG T671 LB T673, LV T673, LT T673, LW T673 LH T674 LS T676, LA T676, LO T676, LY T676, LB T676, LH T676, LSB T676, LW T676 LB T67C, LV T67C, LT T67C, LS T67K, LO T67K, LY T67K, LW E67C LS E67B, LA E67B, LO E67B, LY E67B, LB E67C, LV E67C, LT E67C LW T67C LS T679, LY T679, LG T679 LS T770, LO T770, LY T770, LG T770, LP T770 LB T773, LV T773, LT T773, LW T773 LH T774 LS E675, LA E675, LY E675, LS T675 LS T776, LA T776, LO T776, LY T776, LB T776 LHGB T686 LT T68C, LB T68C - Hyper Mini TOPLED® LB M676 - Mini TOPLED Santana® LG M470 LS M47K, LO M47K, LY M47K Source: http://www.osram.convergy.de LUXEON: - LUMILED® LXK2-PW12-R00, LXK2-PW12-S00, LXK2-PW14-U00, LXK2-PW14-V00 LXK2-PM12-R00, LXK2-PM12-S00, LXK2-PM14-U00 LXK2-PE12-Q00, LXK2-PE12-R00, LXK2-PE12-S00, LXK2-PE14-T00, LXK2-PE14-U00 LXK2-PB12-K00, LXK2-PB12-L00, LXK2-PB12-M00, LXK2-PB14-N00, LXK2-PB14-P00, LXK2-PB14-Q00 LXK2-PR12-L00, LXK2-PR12-M00, LXK2-PR14-Q00, LXK2-PR14-R00 LXK2-PD12-Q00, LXK2-PD12-R00, LXK2-PD12-S00 LXK2-PH12-R00, LXK2-PH12-S00 LXK2-PL12-P00, LXK2-PL12-Q00, LXK2-PL12-R00 Source: www.luxeon.com KINGBRIGHT: KA-3528ASYC Source: www.kingbright.com
Q1 = wavegen:MS1V-T1K
R1-R58 = resistor:R-EU_: RESISTOR, European symbol
S1 = wavegen:TASTER3305
SV1 = con-harting-ml:ML10: HARTING; OC_FARNELL: unknown; OC_NEWARK: unknown
SV2 = con-harting-ml:ML20: HARTING; OC_FARNELL: unknown; OC_NEWARK: unknown
T1 = zetex:NMOSSOT23: MOS FET; OC_FARNELL: unknown; OC_NEWARK: unknown
TP1-TP40 TP51-TP55 = testpad:TP: Test pad
U1 = wavegen:STM32L476RX; MANUFACTURER_PART_NUMBER: stm32l476rx; VENDOR: ST Microelectronics
U2 = wavegen:DAC8734SPFB; MANUFACTURER_PART_NUMBER: DAC8734SPFB; VENDOR: Texas Instruments
U3 U7 U8 U12 = wavegen:THS4271_D_8; MANUFACTURER_PART_NUMBER: ths4271_d_8; VENDOR: Texas Instruments
U4 U5 U9 U10 = wavegen:THS3091_D_8; MANUFACTURER_PART_NUMBER: ths3091_d_8; VENDOR: Texas Instruments
U6 U11 = wavegen:LMH6612MAX/NOPB; MANUFACTURER_PART_NUMBER: LMH6612MAXNOPB; VENDOR: Texas Instruments
VREF1 = wavegen:REF2125
X1 X2 = wavegen:740845_BNC
Y1 = wavegen:ABM8G-12.000MHZ-B4Y-T; MANUFACTURER_PART_NUMBER: ABM8G12.000MHZB4YT; VENDOR: Abracon